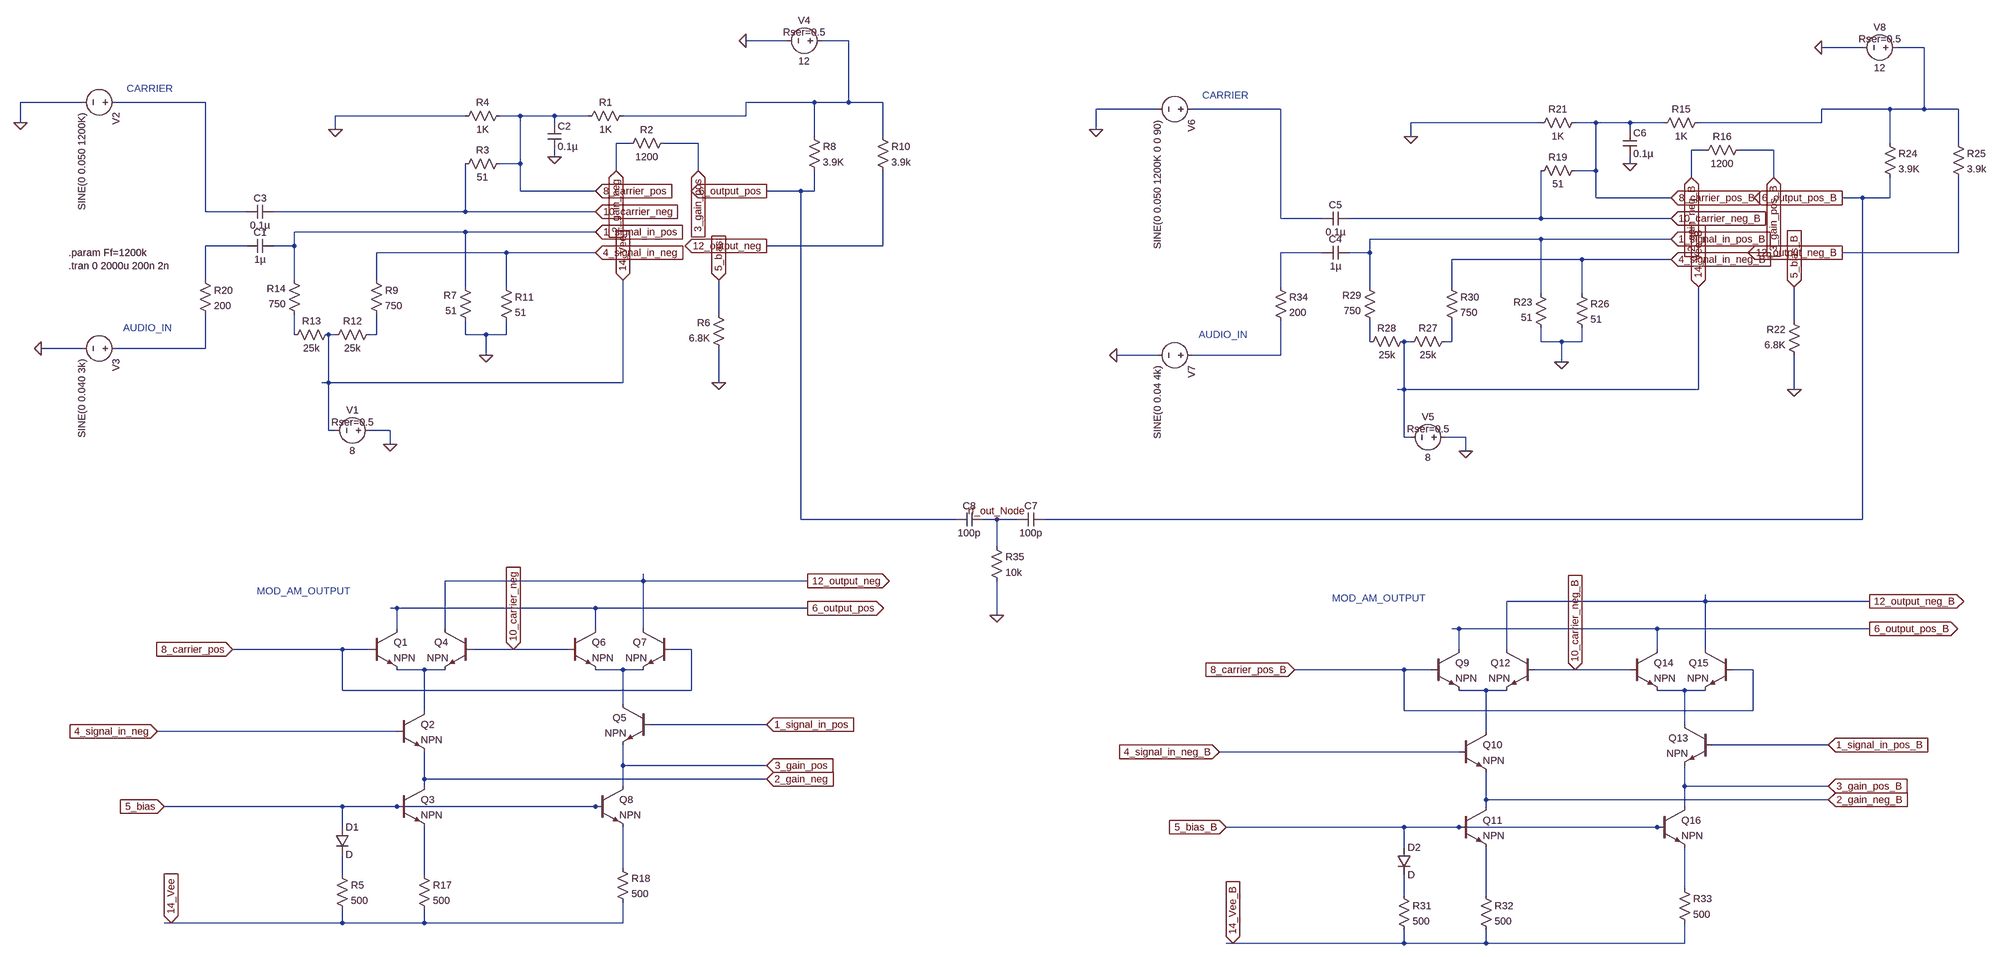
[diagram p0: schematic datasheet_modulator_example.asc]
datasheet_modulator_example.asc, the LTspice schematic file:
Version 4.1
SHEET 1 5516 1676
WIRE 1168 -496 1072 -496
WIRE 1312 -496 1248 -496
WIRE 4352 -480 4256 -480
WIRE 4496 -480 4432 -480
WIRE -480 -352 -624 -352
WIRE -192 -352 -400 -352
WIRE 1232 -352 1072 -352
WIRE 1312 -352 1312 -496
WIRE 1312 -352 1232 -352
WIRE 1392 -352 1312 -352
WIRE 2704 -336 2560 -336
WIRE 2992 -336 2784 -336
WIRE 4416 -336 4256 -336
WIRE 4496 -336 4496 -480
WIRE 4496 -336 4416 -336
WIRE 4576 -336 4496 -336
WIRE 416 -320 112 -320
WIRE 544 -320 496 -320
WIRE 624 -320 544 -320
WIRE 704 -320 624 -320
WIRE 1072 -320 1072 -352
WIRE 1072 -320 784 -320
WIRE -624 -304 -624 -352
WIRE 624 -304 624 -320
WIRE 3600 -304 3296 -304
WIRE 3728 -304 3680 -304
WIRE 3808 -304 3728 -304
WIRE 3888 -304 3808 -304
WIRE 4256 -304 4256 -336
WIRE 4256 -304 3968 -304
WIRE 112 -288 112 -320
WIRE 2560 -288 2560 -336
WIRE 3808 -288 3808 -304
WIRE 1232 -272 1232 -352
WIRE 1392 -272 1392 -352
WIRE 3296 -272 3296 -304
WIRE 800 -256 768 -256
WIRE 960 -256 880 -256
WIRE 4416 -256 4416 -336
WIRE 4576 -256 4576 -336
WIRE 3984 -240 3952 -240
WIRE 4144 -240 4064 -240
WIRE 624 -224 624 -240
WIRE 544 -208 544 -320
WIRE 544 -208 496 -208
WIRE 3808 -208 3808 -224
WIRE 768 -192 768 -256
WIRE 960 -192 960 -256
WIRE 3728 -192 3728 -304
WIRE 3728 -192 3680 -192
WIRE 3952 -176 3952 -240
WIRE 4144 -176 4144 -240
WIRE 544 -144 544 -208
WIRE 720 -144 544 -144
WIRE 1200 -144 1120 -144
WIRE 1232 -144 1232 -192
WIRE 1232 -144 1200 -144
WIRE 3728 -128 3728 -192
WIRE 3904 -128 3728 -128
WIRE 4352 -128 4304 -128
WIRE 4416 -128 4416 -176
WIRE 4416 -128 4352 -128
WIRE -192 -96 -192 -352
WIRE -96 -96 -192 -96
WIRE 416 -96 416 -208
WIRE 416 -96 -32 -96
WIRE 720 -96 416 -96
WIRE 2992 -80 2992 -336
WIRE 3088 -80 2992 -80
WIRE 3600 -80 3600 -192
WIRE 3600 -80 3152 -80
WIRE 3904 -80 3600 -80
WIRE 416 -48 16 -48
WIRE 720 -48 416 -48
WIRE 3600 -32 3200 -32
WIRE 3904 -32 3600 -32
WIRE -96 -16 -192 -16
WIRE 16 -16 16 -48
WIRE 16 -16 -32 -16
WIRE 1392 -16 1392 -192
WIRE 1392 -16 1120 -16
WIRE 512 0 208 0
WIRE 720 0 512 0
WIRE 3088 0 2992 0
WIRE 3200 0 3200 -32
WIRE 3200 0 3152 0
WIRE 4576 0 4576 -176
WIRE 4576 0 4304 0
WIRE 3696 16 3392 16
WIRE 3904 16 3696 16
WIRE -192 64 -192 -16
WIRE 16 64 16 -16
WIRE 208 64 208 0
WIRE 416 80 416 -48
WIRE 512 80 512 0
WIRE 2992 80 2992 0
WIRE 3200 80 3200 0
WIRE 3392 80 3392 16
WIRE 3600 96 3600 -32
WIRE 3696 96 3696 16
WIRE 1008 144 1008 64
WIRE 4192 160 4192 80
WIRE 16 192 16 144
WIRE 112 192 96 192
WIRE 208 192 208 144
WIRE 208 192 192 192
WIRE 416 192 416 160
WIRE 464 192 416 192
WIRE 512 192 512 160
WIRE 512 192 464 192
WIRE 3200 208 3200 160
WIRE 3296 208 3280 208
WIRE 3392 208 3392 160
WIRE 3392 208 3376 208
WIRE 3600 208 3600 176
WIRE 3648 208 3600 208
WIRE 3696 208 3696 176
WIRE 3696 208 3648 208
WIRE -480 224 -576 224
WIRE -192 224 -192 144
WIRE -192 224 -400 224
WIRE 464 240 464 192
WIRE 2704 240 2608 240
WIRE 2992 240 2992 160
WIRE 2992 240 2784 240
WIRE 3648 256 3648 208
WIRE 96 304 96 192
WIRE 96 304 80 304
WIRE 784 304 784 64
WIRE 784 304 96 304
WIRE 1008 304 1008 224
WIRE 3280 320 3280 208
WIRE 3280 320 3264 320
WIRE 3968 320 3968 80
WIRE 3968 320 3280 320
WIRE 4192 320 4192 240
WIRE 96 416 96 304
WIRE 112 416 96 416
WIRE 240 416 192 416
WIRE 3280 432 3280 320
WIRE 3296 432 3280 432
WIRE 3424 432 3376 432
WIRE 240 448 240 416
WIRE 3424 464 3424 432
WIRE 1200 624 1200 -144
WIRE 2192 624 1200 624
WIRE 2288 624 2256 624
WIRE 2336 624 2288 624
WIRE 4352 624 4352 -128
WIRE 4352 624 2400 624
WIRE 2288 688 2288 624
WIRE 832 768 832 752
WIRE 832 768 368 768
WIRE 1216 768 832 768
WIRE 3984 816 3984 800
WIRE 3984 816 3520 816
WIRE 4368 816 3984 816
WIRE 256 832 240 832
WIRE 720 832 256 832
WIRE 1216 832 720 832
WIRE 2288 848 2288 768
WIRE 256 880 256 832
WIRE 368 880 368 768
WIRE 720 880 720 832
WIRE 832 880 832 768
WIRE 3408 880 3392 880
WIRE 3872 880 3408 880
WIRE 4368 880 3872 880
WIRE 128 928 -128 928
WIRE 192 928 128 928
WIRE 528 928 432 928
WIRE 656 928 528 928
WIRE 944 928 896 928
WIRE 3408 928 3408 880
WIRE 3520 928 3520 816
WIRE 3872 928 3872 880
WIRE 3984 928 3984 816
WIRE 320 976 256 976
WIRE 368 976 320 976
WIRE 784 976 720 976
WIRE 832 976 784 976
WIRE 3280 976 3024 976
WIRE 3344 976 3280 976
WIRE 3680 976 3584 976
WIRE 3808 976 3680 976
WIRE 4096 976 4048 976
WIRE 128 1024 128 928
WIRE 944 1024 944 928
WIRE 944 1024 128 1024
WIRE 3472 1024 3408 1024
WIRE 3520 1024 3472 1024
WIRE 3936 1024 3872 1024
WIRE 3984 1024 3936 1024
WIRE 784 1056 784 976
WIRE 320 1072 320 976
WIRE 3280 1072 3280 976
WIRE 4096 1072 4096 976
WIRE 4096 1072 3280 1072
WIRE 1120 1104 848 1104
WIRE 3936 1104 3936 1024
WIRE 256 1120 -304 1120
WIRE 3472 1120 3472 1024
WIRE 4272 1152 4000 1152
WIRE 3408 1168 2848 1168
WIRE 784 1200 784 1152
WIRE 1120 1200 784 1200
WIRE 320 1232 320 1168
WIRE 1120 1232 320 1232
WIRE 320 1248 320 1232
WIRE 784 1248 784 1200
WIRE 3936 1248 3936 1200
WIRE 4272 1248 3936 1248
WIRE 3472 1280 3472 1216
WIRE 4272 1280 3472 1280
WIRE 128 1296 -288 1296
WIRE 256 1296 128 1296
WIRE 720 1296 256 1296
WIRE 736 1296 720 1296
WIRE 3472 1296 3472 1280
WIRE 3936 1296 3936 1248
WIRE 128 1344 128 1296
WIRE 3280 1344 2864 1344
WIRE 3408 1344 3280 1344
WIRE 3872 1344 3408 1344
WIRE 3888 1344 3872 1344
WIRE 3280 1392 3280 1344
WIRE 784 1440 784 1344
WIRE 128 1456 128 1408
WIRE 320 1456 320 1344
WIRE 3936 1488 3936 1392
WIRE 3280 1504 3280 1456
WIRE 3472 1504 3472 1392
WIRE -272 1568 -288 1568
WIRE 128 1568 128 1536
WIRE 128 1568 -272 1568
WIRE 320 1568 320 1536
WIRE 320 1568 128 1568
WIRE 784 1568 784 1520
WIRE 784 1568 320 1568
WIRE 2880 1616 2864 1616
WIRE 3280 1616 3280 1584
WIRE 3280 1616 2880 1616
WIRE 3472 1616 3472 1584
WIRE 3472 1616 3280 1616
WIRE 3936 1616 3936 1568
WIRE 3936 1616 3472 1616
FLAG 240 448 0
FLAG -576 224 0
FLAG 1008 304 0
FLAG 112 -288 0
FLAG 464 240 0
FLAG 624 -224 0
FLAG -624 -304 0
FLAG 1072 -496 0
FLAG 528 928 10_carrier_neg
IOPIN 528 928 In
FLAG -128 928 8_carrier_pos
IOPIN -128 928 In
FLAG 1120 1104 1_signal_in_pos
IOPIN 1120 1104 In
FLAG -304 1120 4_signal_in_neg
IOPIN -304 1120 In
FLAG -288 1296 5_bias
IOPIN -288 1296 In
FLAG -272 1568 14_Vee
IOPIN -272 1568 In
FLAG 1216 768 12_output_neg
IOPIN 1216 768 Out
FLAG 1216 832 6_output_pos
IOPIN 1216 832 Out
FLAG 1120 1200 3_gain_pos
IOPIN 1120 1200 In
FLAG 1120 1232 2_gain_neg
IOPIN 1120 1232 In
FLAG 720 -144 8_carrier_pos
IOPIN 720 -144 In
FLAG 720 -96 10_carrier_neg
IOPIN 720 -96 In
FLAG 720 -48 1_signal_in_pos
IOPIN 720 -48 In
FLAG 720 0 4_signal_in_neg
IOPIN 720 0 In
FLAG 784 64 14_Vee
IOPIN 784 64 In
FLAG 1008 64 5_bias
IOPIN 1008 64 In
FLAG 1120 -16 12_output_neg
IOPIN 1120 -16 Out
FLAG 1120 -144 6_output_pos
IOPIN 1120 -144 Out
FLAG 768 -192 2_gain_neg
IOPIN 768 -192 In
FLAG 960 -192 3_gain_pos
IOPIN 960 -192 In
FLAG 3424 464 0
FLAG 2608 240 0
FLAG 4192 320 0
FLAG 3296 -272 0
FLAG 3648 256 0
FLAG 3808 -208 0
FLAG 2560 -288 0
FLAG 4256 -480 0
FLAG 3680 976 10_carrier_neg_B
IOPIN 3680 976 In
FLAG 3024 976 8_carrier_pos_B
IOPIN 3024 976 In
FLAG 4272 1152 1_signal_in_pos_B
IOPIN 4272 1152 In
FLAG 2848 1168 4_signal_in_neg_B
IOPIN 2848 1168 In
FLAG 2864 1344 5_bias_B
IOPIN 2864 1344 In
FLAG 2880 1616 14_Vee_B
IOPIN 2880 1616 In
FLAG 4368 816 12_output_neg_B
IOPIN 4368 816 Out
FLAG 4368 880 6_output_pos_B
IOPIN 4368 880 Out
FLAG 4272 1248 3_gain_pos_B
IOPIN 4272 1248 In
FLAG 4272 1280 2_gain_neg_B
IOPIN 4272 1280 In
FLAG 3904 -128 8_carrier_pos_B
IOPIN 3904 -128 In
FLAG 3904 -80 10_carrier_neg_B
IOPIN 3904 -80 In
FLAG 3904 -32 1_signal_in_pos_B
IOPIN 3904 -32 In
FLAG 3904 16 4_signal_in_neg_B
IOPIN 3904 16 In
FLAG 3968 80 14_Vee_B
IOPIN 3968 80 In
FLAG 4192 80 5_bias_B
IOPIN 4192 80 In
FLAG 4304 0 12_output_neg_B
IOPIN 4304 0 Out
FLAG 4304 -128 6_output_pos_B
IOPIN 4304 -128 Out
FLAG 3952 -176 2_gain_neg_B
IOPIN 3952 -176 In
FLAG 4144 -176 3_gain_pos_B
IOPIN 4144 -176 In
FLAG 2288 848 0
FLAG 2288 624 rf_out_Node
SYMBOL res 800 -336 R90
WINDOW 0 0 56 VBottom 2
WINDOW 3 32 56 VTop 2
SYMATTR InstName R1
SYMATTR Value 1K
SYMBOL res 896 -272 R90
WINDOW 0 0 56 VBottom 2
WINDOW 3 32 56 VTop 2
SYMATTR InstName R2
SYMATTR Value 1200
SYMBOL res 400 -192 R270
WINDOW 0 32 56 VTop 2
WINDOW 3 0 56 VBottom 2
SYMATTR InstName R3
SYMATTR Value 51
SYMBOL res 400 -304 R270
WINDOW 0 32 56 VTop 2
WINDOW 3 0 56 VBottom 2
SYMATTR InstName R4
SYMATTR Value 1K
SYMBOL res 1024 240 R180
WINDOW 0 36 76 Left 2
WINDOW 3 36 40 Left 2
SYMATTR InstName R6
SYMATTR Value 6.8K
SYMBOL res 432 176 R180
WINDOW 0 36 76 Left 2
WINDOW 3 36 40 Left 2
SYMATTR InstName R7
SYMATTR Value 51
SYMBOL res 1216 -288 R0
SYMATTR InstName R8
SYMATTR Value 3.9K
SYMBOL cap -32 -32 R90
WINDOW 0 0 32 VBottom 2
WINDOW 3 32 32 VTop 2
SYMATTR InstName C1
SYMATTR Value 1µ
SYMBOL cap -32 -112 R90
WINDOW 0 0 32 VBottom 2
WINDOW 3 32 32 VTop 2
SYMATTR InstName C3
SYMATTR Value 0.1µ
SYMBOL voltage 208 416 R90
WINDOW 0 -32 56 VBottom 2
WINDOW 3 32 56 VTop 2
WINDOW 123 0 0 Left 0
WINDOW 39 -4 56 VBottom 2
SYMATTR InstName V1
SYMATTR Value 8
SYMATTR SpiceLine Rser=0.5
SYMBOL voltage -384 -352 R90
WINDOW 123 0 0 Left 0
WINDOW 39 0 0 Left 0
SYMATTR InstName V2
SYMATTR Value SINE(0 0.050 1200K)
SYMBOL voltage -384 224 R90
WINDOW 123 0 0 Left 0
WINDOW 39 0 0 Left 0
SYMATTR InstName V3
SYMATTR Value SINE(0 0.040 3k)
SYMBOL res 1376 -288 R0
SYMATTR InstName R10
SYMATTR Value 3.9k
SYMBOL res 496 64 R0
SYMATTR InstName R11
SYMATTR Value 51
SYMBOL res 208 176 R90
WINDOW 0 0 56 VBottom 2
WINDOW 3 32 56 VTop 2
SYMATTR InstName R12
SYMATTR Value 25k
SYMBOL res 112 176 R90
WINDOW 0 0 56 VBottom 2
WINDOW 3 32 56 VTop 2
SYMATTR InstName R13
SYMATTR Value 25k
SYMBOL res 32 160 R180
WINDOW 0 36 76 Left 2
WINDOW 3 36 40 Left 2
SYMATTR InstName R14
SYMATTR Value 750
SYMBOL res 192 48 R0
SYMATTR InstName R9
SYMATTR Value 750
SYMBOL cap 608 -304 R0
SYMATTR InstName C2
SYMATTR Value 0.1µ
SYMBOL voltage 1264 -496 R90
WINDOW 0 -32 56 VBottom 2
WINDOW 3 32 56 VTop 2
WINDOW 123 0 0 Left 0
WINDOW 39 -4 56 VBottom 2
SYMATTR InstName V4
SYMATTR Value 12
SYMATTR SpiceLine Rser=0.5
SYMBOL npn 192 880 R0
SYMATTR InstName Q1
SYMBOL npn 256 1072 R0
SYMATTR InstName Q2
SYMBOL npn 256 1248 R0
SYMATTR InstName Q3
SYMBOL diode 112 1344 R0
SYMATTR InstName D1
SYMBOL res 112 1440 R0
SYMATTR InstName R5
SYMATTR Value 500
SYMBOL res 304 1440 R0
SYMATTR InstName R17
SYMATTR Value 500
SYMBOL npn 432 880 M0
SYMATTR InstName Q4
SYMBOL npn 848 1056 M0
SYMATTR InstName Q5
SYMBOL npn 656 880 R0
SYMATTR InstName Q6
SYMBOL npn 896 880 M0
SYMATTR InstName Q7
SYMBOL npn 720 1248 R0
SYMATTR InstName Q8
SYMBOL res 768 1424 R0
SYMATTR InstName R18
SYMATTR Value 500
SYMBOL res -208 48 R0
SYMATTR InstName R20
SYMATTR Value 200
SYMBOL res 3984 -320 R90
WINDOW 0 0 56 VBottom 2
WINDOW 3 32 56 VTop 2
SYMATTR InstName R15
SYMATTR Value 1K
SYMBOL res 4080 -256 R90
WINDOW 0 0 56 VBottom 2
WINDOW 3 32 56 VTop 2
SYMATTR InstName R16
SYMATTR Value 1200
SYMBOL res 3584 -176 R270
WINDOW 0 32 56 VTop 2
WINDOW 3 0 56 VBottom 2
SYMATTR InstName R19
SYMATTR Value 51
SYMBOL res 3584 -288 R270
WINDOW 0 32 56 VTop 2
WINDOW 3 0 56 VBottom 2
SYMATTR InstName R21
SYMATTR Value 1K
SYMBOL res 4208 256 R180
WINDOW 0 36 76 Left 2
WINDOW 3 36 40 Left 2
SYMATTR InstName R22
SYMATTR Value 6.8K
SYMBOL res 3616 192 R180
WINDOW 0 36 76 Left 2
WINDOW 3 36 40 Left 2
SYMATTR InstName R23
SYMATTR Value 51
SYMBOL res 4400 -272 R0
SYMATTR InstName R24
SYMATTR Value 3.9K
SYMBOL cap 3152 -16 R90
WINDOW 0 0 32 VBottom 2
WINDOW 3 32 32 VTop 2
SYMATTR InstName C4
SYMATTR Value 1µ
SYMBOL cap 3152 -96 R90
WINDOW 0 0 32 VBottom 2
WINDOW 3 32 32 VTop 2
SYMATTR InstName C5
SYMATTR Value 0.1µ
SYMBOL voltage 3392 432 R90
WINDOW 0 -32 56 VBottom 2
WINDOW 3 32 56 VTop 2
WINDOW 123 0 0 Left 0
WINDOW 39 -4 56 VBottom 2
SYMATTR InstName V5
SYMATTR Value 8
SYMATTR SpiceLine Rser=0.5
SYMBOL voltage 2800 -336 R90
WINDOW 123 0 0 Left 0
WINDOW 39 0 0 Left 0
SYMATTR InstName V6
SYMATTR Value SINE(0 0.050 1200K 0 0 90)
SYMBOL voltage 2800 240 R90
WINDOW 123 0 0 Left 0
WINDOW 39 0 0 Left 0
SYMATTR InstName V7
SYMATTR Value SINE(0 0.04 4k)
SYMBOL res 4560 -272 R0
SYMATTR InstName R25
SYMATTR Value 3.9k
SYMBOL res 3680 80 R0
SYMATTR InstName R26
SYMATTR Value 51
SYMBOL res 3392 192 R90
WINDOW 0 0 56 VBottom 2
WINDOW 3 32 56 VTop 2
SYMATTR InstName R27
SYMATTR Value 25k
SYMBOL res 3296 192 R90
WINDOW 0 0 56 VBottom 2
WINDOW 3 32 56 VTop 2
SYMATTR InstName R28
SYMATTR Value 25k
SYMBOL res 3216 176 R180
WINDOW 0 36 76 Left 2
WINDOW 3 36 40 Left 2
SYMATTR InstName R29
SYMATTR Value 750
SYMBOL res 3376 64 R0
SYMATTR InstName R30
SYMATTR Value 750
SYMBOL cap 3792 -288 R0
SYMATTR InstName C6
SYMATTR Value 0.1µ
SYMBOL voltage 4448 -480 R90
WINDOW 0 -32 56 VBottom 2
WINDOW 3 32 56 VTop 2
WINDOW 123 0 0 Left 0
WINDOW 39 -4 56 VBottom 2
SYMATTR InstName V8
SYMATTR Value 12
SYMATTR SpiceLine Rser=0.5
SYMBOL npn 3344 928 R0
SYMATTR InstName Q9
SYMBOL npn 3408 1120 R0
SYMATTR InstName Q10
SYMBOL npn 3408 1296 R0
SYMATTR InstName Q11
SYMBOL diode 3264 1392 R0
SYMATTR InstName D2
SYMBOL res 3264 1488 R0
SYMATTR InstName R31
SYMATTR Value 500
SYMBOL res 3456 1488 R0
SYMATTR InstName R32
SYMATTR Value 500
SYMBOL npn 3584 928 M0
SYMATTR InstName Q12
SYMBOL npn 4000 1104 M0
SYMATTR InstName Q13
SYMBOL npn 3808 928 R0
SYMATTR InstName Q14
SYMBOL npn 4048 928 M0
SYMATTR InstName Q15
SYMBOL npn 3872 1296 R0
SYMATTR InstName Q16
SYMBOL res 3920 1472 R0
SYMATTR InstName R33
SYMATTR Value 500
SYMBOL res 2976 64 R0
SYMATTR InstName R34
SYMATTR Value 200
SYMBOL cap 2400 608 R90
WINDOW 0 0 32 VBottom 2
WINDOW 3 32 32 VTop 2
SYMATTR InstName C7
SYMATTR Value 100p
SYMBOL cap 2256 608 R90
WINDOW 0 0 32 VBottom 2
WINDOW 3 32 32 VTop 2
SYMATTR InstName C8
SYMATTR Value 100p
SYMBOL res 2272 672 R0
SYMATTR InstName R35
SYMATTR Value 10k
TEXT -376 -384 Left 2 ;CARRIER
TEXT -384 176 Left 2 ;AUDIO_IN
TEXT -72 792 Left 2 ;MOD_AM_OUTPUT
TEXT -512 0 Left 2 !.param Ff=1200k\n.tran 0 2000u 200n 2n
TEXT 2808 -368 Left 2 ;CARRIER
TEXT 2800 192 Left 2 ;AUDIO_IN
TEXT 3112 808 Left 2 ;MOD_AM_OUTPUT

The netlist it stands for:
* datasheet_modulator_example.asc
R1 N001 8_carrier_pos 1K
R2 3_gain_pos 2_gain_neg 1200
R3 10_carrier_neg 8_carrier_pos 51
R4 0 8_carrier_pos 1K
R6 0 5_bias 6.8K
R7 0 1_signal_in_pos 51
R8 N001 6_output_pos 3.9K
C1 1_signal_in_pos N005 1µ
C3 10_carrier_neg N003 0.1µ
V1 0 14_Vee 8 Rser=0.5
V2 N003 0 SINE(0 0.050 1200K)
V3 N011 0 SINE(0 0.040 3k)
R10 N001 12_output_neg 3.9k
R11 4_signal_in_neg 0 51
R12 N008 14_Vee 25k
R13 14_Vee N007 25k
R14 N007 1_signal_in_pos 750
R9 4_signal_in_neg N008 750
C2 8_carrier_pos 0 0.1µ
V4 N001 0 12 Rser=0.5
Q1 6_output_pos 8_carrier_pos N013 0 NPN
Q2 N013 4_signal_in_neg 2_gain_neg 0 NPN
Q3 2_gain_neg 5_bias N019 0 NPN
D1 5_bias N018 D
R5 N018 14_Vee 500
R17 N019 14_Vee 500
Q4 12_output_neg 10_carrier_neg N013 0 NPN
Q5 N014 1_signal_in_pos 3_gain_pos 0 NPN
Q6 6_output_pos 10_carrier_neg N014 0 NPN
Q7 12_output_neg 8_carrier_pos N014 0 NPN
Q8 3_gain_pos 5_bias N017 0 NPN
R18 N017 14_Vee 500
R20 N005 N011 200
R15 N002 8_carrier_pos_B 1K
R16 3_gain_pos_B 2_gain_neg_B 1200
R19 10_carrier_neg_B 8_carrier_pos_B 51
R21 0 8_carrier_pos_B 1K
R22 0 5_bias_B 6.8K
R23 0 1_signal_in_pos_B 51
R24 N002 6_output_pos_B 3.9K
C4 1_signal_in_pos_B N006 1µ
C5 10_carrier_neg_B N004 0.1µ
V5 0 14_Vee_B 8 Rser=0.5
V6 N004 0 SINE(0 0.050 1200K 0 0 90)
V7 N012 0 SINE(0 0.04 4k)
R25 N002 12_output_neg_B 3.9k
R26 4_signal_in_neg_B 0 51
R27 N010 14_Vee_B 25k
R28 14_Vee_B N009 25k
R29 N009 1_signal_in_pos_B 750
R30 4_signal_in_neg_B N010 750
C6 8_carrier_pos_B 0 0.1µ
V8 N002 0 12 Rser=0.5
Q9 6_output_pos_B 8_carrier_pos_B N015 0 NPN
Q10 N015 4_signal_in_neg_B 2_gain_neg_B 0 NPN
Q11 2_gain_neg_B 5_bias_B N022 0 NPN
D2 5_bias_B N021 D
R31 N021 14_Vee_B 500
R32 N022 14_Vee_B 500
Q12 12_output_neg_B 10_carrier_neg_B N015 0 NPN
Q13 N016 1_signal_in_pos_B 3_gain_pos_B 0 NPN
Q14 6_output_pos_B 10_carrier_neg_B N016 0 NPN
Q15 12_output_neg_B 8_carrier_pos_B N016 0 NPN
Q16 3_gain_pos_B 5_bias_B N020 0 NPN
R33 N020 14_Vee_B 500
R34 N006 N012 200
C7 6_output_pos_B rf_out_Node 100p
C8 rf_out_Node 6_output_pos 100p
R35 rf_out_Node 0 10k
.model D D
.lib standard.dio
.model NPN NPN
.model PNP PNP
.lib standard.bjt
* CARRIER
* AUDIO_IN
* MOD_AM_OUTPUT
.param Ff=1200k
.tran 0 2000u 200n 2n
* CARRIER
* AUDIO_IN
* MOD_AM_OUTPUT
.backanno
.end